# Altium schematic sheet vca_A.SchDoc
size 381 x 241 mm; SheetNumber: 1; SheetTotal: 2
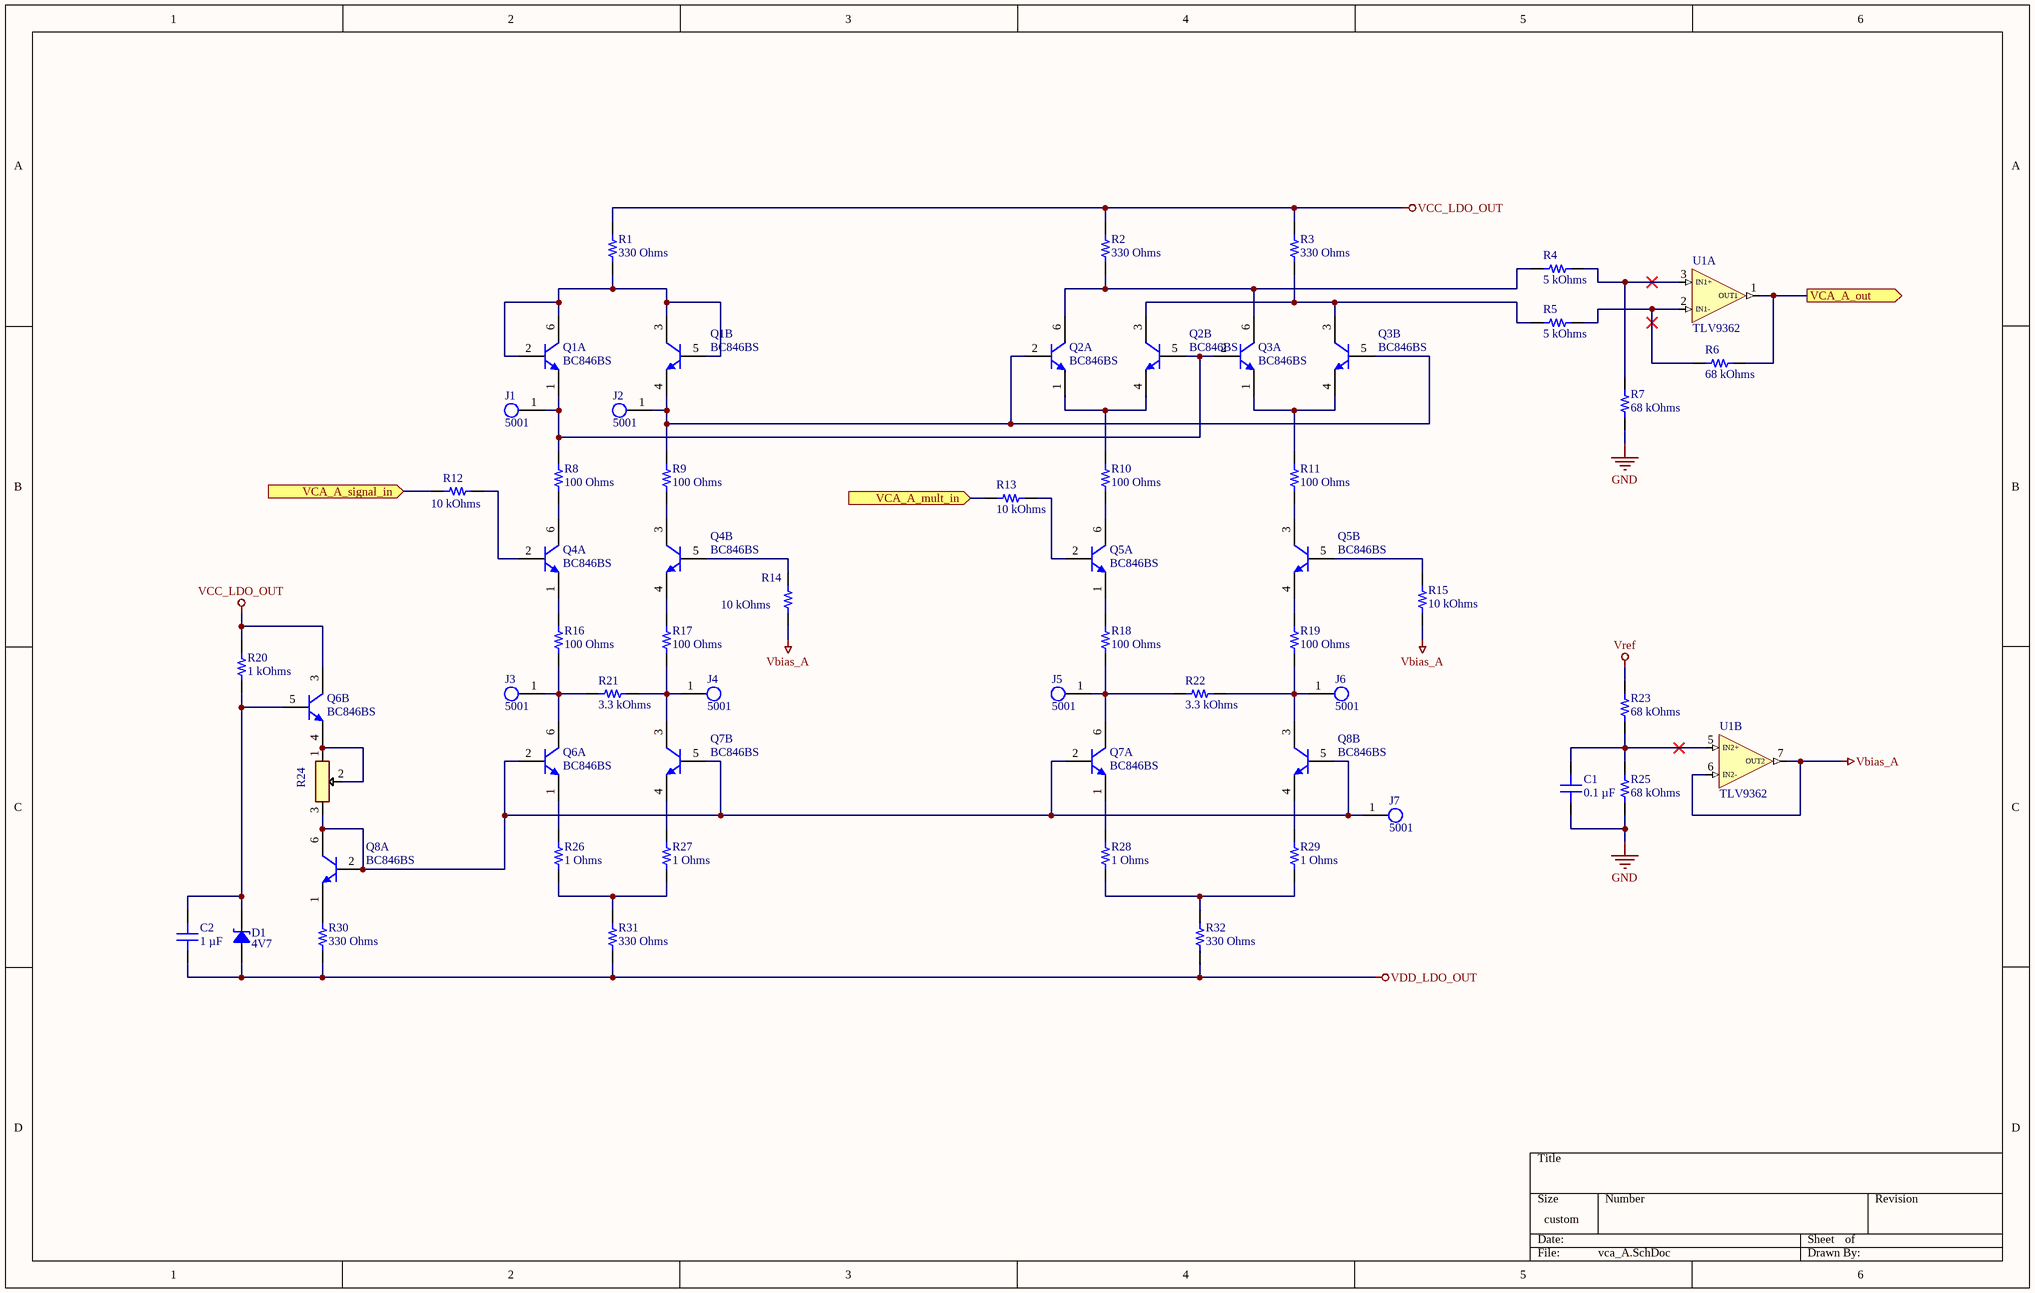
[diagram p0: vca_A.SchDoc]

## Parts
C1  0.1 µF  [CAP 1206_3216 - 0.8MM]
C2  1 µF  [CAP 1206_3216 - 0.8MM]
D1  4V7  [SOD323]
J1  5001  [FP-5001-MFG]
J2  5001  [FP-5001-MFG]
J3  5001  [FP-5001-MFG]
J4  5001  [FP-5001-MFG]
J5  5001  [FP-5001-MFG]
J6  5001  [FP-5001-MFG]
J7  5001  [FP-5001-MFG]
Q1  BC846BS  [TSOP65P210X110-6N]  (parts A,B of 2)
Q2  BC846BS  [TSOP65P210X110-6N]  (parts A,B of 2)
Q3  BC846BS  [TSOP65P210X110-6N]  (parts A,B of 2)
Q4  BC846BS  [TSOP65P210X110-6N]  (parts A,B of 2)
Q5  BC846BS  [TSOP65P210X110-6N]  (parts A,B of 2)
Q6  BC846BS  [TSOP65P210X110-6N]  (parts A,B of 2)
Q7  BC846BS  [TSOP65P210X110-6N]  (parts A,B of 2)
Q8  BC846BS  [TSOP65P210X110-6N]  (parts A,B of 2)
R1  330 Ohms  [YAGEO RES 1206_3216]
R2  330 Ohms  [YAGEO RES 1206_3216]
R3  330 Ohms  [YAGEO RES 1206_3216]
R4  5 kOhms  [YAGEO RES 1206_3216]
R5  5 kOhms  [YAGEO RES 1206_3216]
R6  68 kOhms  [YAGEO RES 1206_3216]
R7  68 kOhms  [YAGEO RES 1206_3216]
R8  100 Ohms  [YAGEO RES 1206_3216]
R9  100 Ohms  [YAGEO RES 1206_3216]
R10  100 Ohms  [YAGEO RES 1206_3216]
R11  100 Ohms  [YAGEO RES 1206_3216]
R12  10 kOhms  [YAGEO RES 1206_3216]
R13  10 kOhms  [YAGEO RES 1206_3216]
R14  10 kOhms  [YAGEO RES 1206_3216]
R15  10 kOhms  [YAGEO RES 1206_3216]
R16  100 Ohms  [YAGEO RES 1206_3216]
R17  100 Ohms  [YAGEO RES 1206_3216]
R18  100 Ohms  [YAGEO RES 1206_3216]
R19  100 Ohms  [YAGEO RES 1206_3216]
R20  1 kOhms  [YAGEO RES 1206_3216]
R21  3.3 kOhms  [YAGEO RES 1206_3216]
R22  3.3 kOhms  [YAGEO RES 1206_3216]
R23  68 kOhms  [YAGEO RES 1206_3216]
R24  TC33X-2-502G  [TC33X2503E]  (value not drawn)
R25  68 kOhms  [YAGEO RES 1206_3216]
R26  1 Ohms  [YAGEO RES 1206_3216]
R27  1 Ohms  [YAGEO RES 1206_3216]
R28  1 Ohms  [YAGEO RES 1206_3216]
R29  1 Ohms  [YAGEO RES 1206_3216]
R30  330 Ohms  [YAGEO RES 1206_3216]
R31  330 Ohms  [YAGEO RES 1206_3216]
R32  330 Ohms  [YAGEO RES 1206_3216]
U1  TLV9362  [SOIC8-127P600X175-8N]  (parts A,B of 3)

## Ports
VCA_A_mult_in (in), VCA_A_out (out), VCA_A_signal_in (in)

## Nets
GND: C1.1 R7.2 R25.1
Vbias_A: R14.1 R15.1 U1.6(IN2-) U1.7(OUT2)
VCC_LDO_OUT: Q6.3(C2) R1.2 R2.2 R3.2 R20.2
VDD_LDO_OUT: C2.1 D1.1 R30.1 R31.1 R32.1
Vref: R23.2
VCA_A_mult_in: R13.1 ; port VCA_A_mult_in
VCA_A_out: R6.1 U1.1(OUT1) ; port VCA_A_out
VCA_A_signal_in: R12.1 ; port VCA_A_signal_in
NetC1_2: C1.2 R23.1 R25.2 U1.5(IN2+)
NetC2_2: C2.2 D1.2 Q6.5(B2) R20.1
NetJ1_1: J1.1 Q1.1(E1) Q2.5(B2) Q3.2(B1) R8.2
NetJ2_1: J2.1 Q1.4(E2) Q2.2(B1) Q3.5(B2) R9.2
NetJ3_1: J3.1 Q6.6(C1) R16.1 R21.2
NetJ4_1: J4.1 Q7.3(C2) R17.1 R21.1
NetJ5_1: J5.1 Q7.6(C1) R18.1 R22.2
NetJ6_1: J6.1 Q8.3(C2) R19.1 R22.1
NetJ7_1: J7.1 Q6.2(B1) Q7.2(B1) Q7.5(B2) Q8.2(B1) Q8.5(B2) Q8.6(C1) R24.3(CW)
NetQ1_2: Q1.2(B1) Q1.3(C2) Q1.5(B2) Q1.6(C1) R1.1
NetQ2_1: Q2.1(E1) Q2.4(E2) R10.2
NetQ2_3: Q2.3(C2) Q3.3(C2) R3.1 R5.2
NetQ2_6: Q2.6(C1) Q3.6(C1) R2.1 R4.2
NetQ3_1: Q3.1(E1) Q3.4(E2) R11.2
NetQ4_1: Q4.1(E1) R16.2
NetQ4_2: Q4.2(B1) R12.2
NetQ4_3: Q4.3(C2) R9.1
NetQ4_4: Q4.4(E2) R17.2
NetQ4_5: Q4.5(B2) R14.2
NetQ4_6: Q4.6(C1) R8.1
NetQ5_1: Q5.1(E1) R18.2
NetQ5_2: Q5.2(B1) R13.2
NetQ5_3: Q5.3(C2) R11.1
NetQ5_4: Q5.4(E2) R19.2
NetQ5_5: Q5.5(B2) R15.2
NetQ5_6: Q5.6(C1) R10.1
NetQ6_1: Q6.1(E1) R26.2
NetQ6_4: Q6.4(E2) R24.1(CCW) R24.2(W)
NetQ7_1: Q7.1(E1) R28.2
NetQ7_4: Q7.4(E2) R27.2
NetQ8_1: Q8.1(E1) R30.2
NetQ8_4: Q8.4(E2) R29.2
NetR4_1: R4.1 R7.1 U1.3(IN1+)
NetR5_1: R5.1 R6.2 U1.2(IN1-)
NetR26_1: R26.1 R27.1 R31.2
NetR28_1: R28.1 R29.1 R32.2

## Library data of the parts
C1 = 885012208087: CAP CER 0.1UF 50V X7R 1206; manufacturer: Würth Elektronik; Tolerance: ±10%; Part Number: 885012208087; Capacitance: 0.1 µF; Applications: General Purpose; componentlink1description: Datasheet; componentlink1url: https://katalog.we-online.de/pbs/datasheet/885012208087.pdf; componentlink2description: DigiKey Link; componentlink2url: https://www.digikey.com/en/products/detail/würth-elektronik/885012208087/5453982; Device Package: 1206 (3216 Metric); lastupdated: 6/4/2024 19:10:27; Lifecycle Status: Active; Minimum Order: 1; Mounting Type: Surface Mount, MLCC; Operating Temperature: -55°C ~ 125°C; Package / Case: 1206 (3216 Metric); packaging: TapeAndReel; partid: 20879; Part Status: Active; price: 0.06; series: WCAP-CSGP; Size / Dimension: 0.126" L x 0.063" W (3.20mm x 1.60mm); Supplier 1: DigiKey; Supplier Part Number 1: 732-8127-1-ND; Temperature Coefficient: X7R; Thickness (Max): 0.035" (0.90mm); value: 0.1 µF; Voltage - Rated: 50V
C2 = 885012208093: CAP CER 1UF 50V X7R 1206; manufacturer: Würth Elektronik; Tolerance: ±10%; Part Number: 885012208093; Capacitance: 1 µF; Applications: General Purpose; componentlink1description: Datasheet; componentlink1url: https://katalog.we-online.de/pbs/datasheet/885012208093.pdf; componentlink2description: DigiKey Link; componentlink2url: https://www.digikey.com/en/products/detail/würth-elektronik/885012208093/5453432; Device Package: 1206 (3216 Metric); lastupdated: 6/4/2024 19:10:33; Lifecycle Status: Active; Minimum Order: 1; Mounting Type: Surface Mount, MLCC; Operating Temperature: -55°C ~ 125°C; Package / Case: 1206 (3216 Metric); packaging: TapeAndReel; partid: 39665; Part Status: Active; price: 0.10; series: WCAP-CSGP; Size / Dimension: 0.126" L x 0.063" W (3.20mm x 1.60mm); Supplier 1: DigiKey; Supplier Part Number 1: 732-7577-1-ND; Temperature Coefficient: X7R; Thickness (Max): 0.075" (1.90mm); value: 1 µF; Voltage - Rated: 50V
D1 = BZX38450-C4V7X
J1-J7 = CMP-2000-05181-2: PC TEST POINT MINIATURE BLACK; Body Material: Bronze; Plating: Silver; Inside Diameter: 1.27mm; Hole Diameter: 1.6mm; Number of Ports: 1; Outside Diameter: 2.54mm; Insulation: Insulated; Insulation Material: Nylon; Mount: Through Hole; RoHS Compliant: Yes; Series: THM; Height: 0.3inch; Termination: Through Hole; Material: Nylon; Packaging: Bulk; Contact Material: Bronze; REACH SVHC: No SVHC; Contact Plating: Silver; Orientation: Straight; Lead Free: Lead Free; Package Quantity: 100; Length: 7.62mm; Flammability Rating: UL94 V-0; Number of Contacts: 1; Diameter: 2.54mm; Housing Color: Black; Color: Black
Q1-Q8 = BC846BS: 65 V, 100 mA matched NPN/NPN general-purpose transistor; ComponentLink1Description: Datasheet; ComponentLink1URL: https://assets.nexperia.com/documents/data-sheet/BC846BS.pdf
R1-R3 R30-R32 = RT1206FRD07330RL: RES SMD 330 OHM 1% 1/4W 1206; Manufacturer: Yageo; Power (Watts): 0.25W, 1/4W; Temperature Coefficient: ±25ppm/°C; Part Number: RT1206FRD07330RL; ComponentLink1Description: Datasheet; ComponentLink1URL: https://www.yageo.com/upload/media/product/productsearch/datasheet/rchip/PYu-RT_1-to-0.01_RoHS_L_15.pdf; ComponentLink2Description: DigiKey Link; ComponentLink2URL: https://www.digikey.com/en/products/detail/yageo/RT1206FRD07330RL/5938576; Composition: Thin Film; Device Package: 1206 (3216 Metric); Height - Seated (Max): 0.026" (0.65mm); LastUpdated: 7/25/2024 09:21:16; Lifecycle Status: Active; Minimum Order: 1; Number of Terminations: 2; Operating Temperature: -55°C ~ 155°C; Package / Case: 1206 (3216 Metric); Packaging: TapeAndReel; PartId: 79140; Price: 0.01; Resistance: 330 Ohms; Series: RT; Size / Dimension: 0.122" L x 0.063" W (3.10mm x 1.60mm); Supplier 1: DigiKey; Supplier Part Number 1: 13-RT1206FRD07330RLCT-ND; Supplier Device Package: 1206; Tolerance: ±1%; Value: 330 Ohms
R4 R5 = RT1206FRE075KL: RES 5K OHM 1% 1/4W 1206; Manufacturer: Yageo; Power (Watts): 0.25W, 1/4W; Temperature Coefficient: ±50ppm/°C; Part Number: RT1206FRE075KL; ComponentLink1Description: Datasheet; ComponentLink1URL: https://www.yageo.com/upload/media/product/app/datasheet/rchip/pyu-rt_1-to-0.01_rohs_l.pdf; ComponentLink2Description: DigiKey Link; ComponentLink2URL: https://www.digikey.com/en/products/detail/yageo/RT1206FRE075KL/7708705; Composition: Thin Film; Device Package: 1206 (3216 Metric); Height - Seated (Max): 0.026" (0.65mm); LastUpdated: 7/25/2024 09:21:03; Lifecycle Status: Active; Minimum Order: 1; Number of Terminations: 2; Operating Temperature: -55°C ~ 155°C; Package / Case: 1206 (3216 Metric); Packaging: TapeAndReel; PartId: 88354; Price: 0.01; Resistance: 5 kOhms; Series: RT; Size / Dimension: 0.122" L x 0.063" W (3.10mm x 1.60mm); Supplier 1: DigiKey; Supplier Part Number 1: 13-RT1206FRE075KLCT-ND; Supplier Device Package: 1206; Tolerance: ±1%; Value: 5 kOhms
R6 R7 R23 R25 = RT1206FRE0768KL: RES SMD 68K OHM 1% 1/4W 1206; Manufacturer: Yageo; Power (Watts): 0.25W, 1/4W; Temperature Coefficient: ±50ppm/°C; Part Number: RT1206FRE0768KL; ComponentLink1Description: Datasheet; ComponentLink1URL: https://www.yageo.com/upload/media/product/productsearch/datasheet/rchip/PYu-RT_1-to-0.01_RoHS_L_12.pdf; ComponentLink2Description: DigiKey Link; ComponentLink2URL: https://www.digikey.com/en/products/detail/yageo/RT1206FRE0768KL/1083332; Composition: Thin Film; Device Package: 1206 (3216 Metric); Height - Seated (Max): 0.026" (0.65mm); LastUpdated: 7/25/2024 09:21:23; Lifecycle Status: Active; Minimum Order: 1; Number of Terminations: 2; Operating Temperature: -55°C ~ 155°C; Package / Case: 1206 (3216 Metric); Packaging: TapeAndReel; PartId: 58462; Part Status: Active; Price: 0.01; Resistance: 68 kOhms; Series: RT; Size / Dimension: 0.122" L x 0.063" W (3.10mm x 1.60mm); Supplier 1: DigiKey; Supplier Part Number 1: 13-RT1206FRE0768KLCT-ND; Supplier Device Package: 1206; Tolerance: ±1%; Value: 68 kOhms
R8-R11 R16-R19 = RT1206FRD07100RL: RES SMD 100 OHM 1% 1/4W 1206; Manufacturer: Yageo; Power (Watts): 0.25W, 1/4W; Temperature Coefficient: ±25ppm/°C; Part Number: RT1206FRD07100RL; ComponentLink1Description: Datasheet; ComponentLink1URL: https://www.yageo.com/upload/media/product/productsearch/datasheet/rchip/PYu-RT_1-to-0.01_RoHS_L_12.pdf; ComponentLink2Description: DigiKey Link; ComponentLink2URL: https://www.digikey.com/en/products/detail/yageo/RT1206FRD07100RL/5938292; Composition: Thin Film; Device Package: 1206 (3216 Metric); Height - Seated (Max): 0.026" (0.65mm); LastUpdated: 7/25/2024 09:21:23; Lifecycle Status: Active; Minimum Order: 1; Number of Terminations: 2; Operating Temperature: -55°C ~ 155°C; Package / Case: 1206 (3216 Metric); Packaging: TapeAndReel; PartId: 58461; Part Status: Active; Price: 0.01; Resistance: 100 Ohms; Series: RT; Size / Dimension: 0.122" L x 0.063" W (3.10mm x 1.60mm); Supplier 1: DigiKey; Supplier Part Number 1: 13-RT1206FRD07100RLCT-ND; Supplier Device Package: 1206; Tolerance: ±1%; Value: 100 Ohms
R12-R15 = RT1206FRE0710KL: RES SMD 10K OHM 1% 1/4W 1206; Manufacturer: Yageo; Power (Watts): 0.25W, 1/4W; Temperature Coefficient: ±50ppm/°C; Part Number: RT1206FRE0710KL; ComponentLink1Description: Datasheet; ComponentLink1URL: https://www.yageo.com/upload/media/product/productsearch/datasheet/rchip/PYu-RT_1-to-0.01_RoHS_L_11.pdf; ComponentLink2Description: DigiKey Link; ComponentLink2URL: https://www.digikey.com/en/products/detail/yageo/RT1206FRE0710KL/1082868; Composition: Thin Film; Device Package: 1206 (3216 Metric); Height - Seated (Max): 0.026" (0.65mm); LastUpdated: 7/25/2024 09:21:28; Lifecycle Status: Active; Minimum Order: 1; Number of Terminations: 2; Operating Temperature: -55°C ~ 155°C; Package / Case: 1206 (3216 Metric); Packaging: TapeAndReel; PartId: 38903; Part Status: Active; Price: 0.01; Resistance: 10 kOhms; Series: RT; Size / Dimension: 0.122" L x 0.063" W (3.10mm x 1.60mm); Supplier 1: DigiKey; Supplier Part Number 1: YAG1242CT-ND; Supplier Device Package: 1206; Tolerance: ±1%; Value: 10 kOhms
R20 = RT1206FRE071KL: RES SMD 1K OHM 1% 1/4W 1206; Manufacturer: Yageo; Power (Watts): 0.25W, 1/4W; Temperature Coefficient: ±50ppm/°C; Part Number: RT1206FRE071KL; ComponentLink1Description: Datasheet; ComponentLink1URL: https://www.yageo.com/upload/media/product/productsearch/datasheet/rchip/PYu-RT_1-to-0.01_RoHS_L_11.pdf; ComponentLink2Description: DigiKey Link; ComponentLink2URL: https://www.digikey.com/en/products/detail/yageo/RT1206FRE071KL/1083016; Composition: Thin Film; Device Package: 1206 (3216 Metric); Height - Seated (Max): 0.026" (0.65mm); LastUpdated: 7/25/2024 09:21:27; Lifecycle Status: Active; Minimum Order: 1; Number of Terminations: 2; Operating Temperature: -55°C ~ 155°C; Package / Case: 1206 (3216 Metric); Packaging: TapeAndReel; PartId: 40465; Part Status: Active; Price: 0.01; Resistance: 1 kOhms; Series: RT; Size / Dimension: 0.122" L x 0.063" W (3.10mm x 1.60mm); Supplier 1: DigiKey; Supplier Part Number 1: YAG3366CT-ND; Supplier Device Package: 1206; Tolerance: ±1%; Value: 1 kOhms
R21 R22 = RT1206FRE073K3L: RES SMD 3.3K OHM 1% 1/4W 1206; Manufacturer: Yageo; Power (Watts): 0.25W, 1/4W; Temperature Coefficient: ±50ppm/°C; Part Number: RT1206FRE073K3L; ComponentLink1Description: Datasheet; ComponentLink1URL: https://www.yageo.com/upload/media/product/productsearch/datasheet/rchip/PYu-RT_1-to-0.01_RoHS_L_12.pdf; ComponentLink2Description: DigiKey Link; ComponentLink2URL: https://www.digikey.com/en/products/detail/yageo/RT1206FRE073K3L/1083187; Composition: Thin Film; Device Package: 1206 (3216 Metric); Height - Seated (Max): 0.026" (0.65mm); LastUpdated: 7/25/2024 09:21:22; Lifecycle Status: Active; Minimum Order: 1; Number of Terminations: 2; Operating Temperature: -55°C ~ 155°C; Package / Case: 1206 (3216 Metric); Packaging: TapeAndReel; PartId: 58380; Price: 0.01; Resistance: 3.3 kOhms; Series: RT; Size / Dimension: 0.122" L x 0.063" W (3.10mm x 1.60mm); Supplier 1: DigiKey; Supplier Part Number 1: 13-RT1206FRE073K3LCT-ND; Supplier Device Package: 1206; Tolerance: ±1%; Value: 3.3 kOhms; Part Status: Active
R24 = TC33X-2-502G: Resistor; Manufacturer_Name: Bourns; Datasheet Link: https://componentsearchengine.com/Datasheets/1/TC33X-2-502G.pdf; Height: 1.2mm; Manufacturer_Part_Number: TC33X-2-502G; Mouser Part Number: 652-TC33X-2-502G; Mouser Price/Stock: https://www.mouser.co.uk/ProductDetail/Bourns/TC33X-2-502G?qs=UmpSLsh52mVfPYqLYJpjzQ%3D%3D; Arrow Part Number: TC33X-2-502G; Arrow Price/Stock: https://www.arrow.com/en/products/tc33x-2-502g/bourns?region=nac
R26-R29 = RT1206BRD071RL: RES 1 OHM 0.1% 1/4W 1206; Manufacturer: Yageo; Power (Watts): 0.25W, 1/4W; Temperature Coefficient: ±25ppm/°C; Part Number: RT1206BRD071RL; ComponentLink1Description: Datasheet; ComponentLink1URL: https://www.yageo.com/upload/media/product/productsearch/datasheet/rchip/PYu-RT_1-to-0.01_RoHS_L_15.pdf; ComponentLink2Description: DigiKey Link; ComponentLink2URL: https://www.digikey.com/en/products/detail/yageo/RT1206BRD071RL/17018181; Composition: Thin Film; Device Package: 1206 (3216 Metric); Features: Moisture Resistant; Height - Seated (Max): 0.026" (0.65mm); LastUpdated: 7/25/2024 09:21:16; Lifecycle Status: Active; Minimum Order: 1; Number of Terminations: 2; Operating Temperature: -55°C ~ 155°C; Package / Case: 1206 (3216 Metric); Packaging: TapeAndReel; PartId: 79150; Price: 0.14; Resistance: 1 Ohms; Series: RT; Size / Dimension: 0.122" L x 0.063" W (3.10mm x 1.60mm); Supplier 1: DigiKey; Supplier Part Number 1: 13-RT1206BRD071RLCT-ND; Supplier Device Package: 1206; Tolerance: ±0.1%; Value: 1 Ohms
U1 = TLV9362: TLV936x 10-MHz, 40-V, RRO, Operational Amplifie; ComponentLink1Description: Datasheet; ComponentLink1URL: https://www.ti.com/lit/ds/symlink/tlv9362.pdf